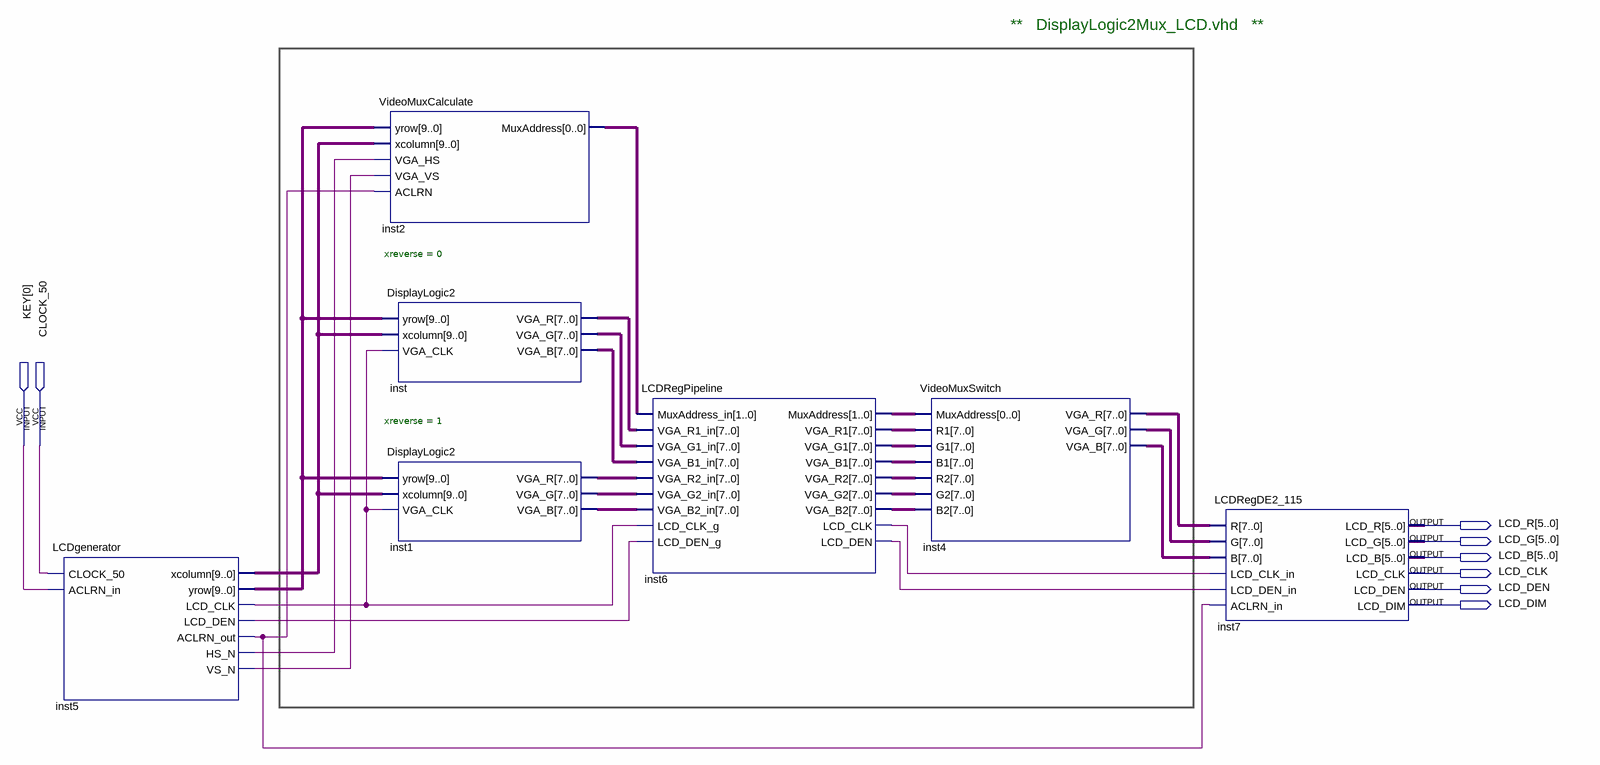
[diagram p0: schematic sheet]
// Quartus schematic DemoMux_LCD_OverviewInBDF.bdf as structural Verilog: 7 symbols, 8 pins
module DemoMux_LCD_OverviewInBDF (
  input  [0:0] KEY,
  input  CLOCK_50,
  output [5:0] LCD_R,
  output [5:0] LCD_G,
  output [5:0] LCD_B,
  output LCD_CLK,
  output LCD_DEN,
  output LCD_DIM
);

  wire inst5_aclrn_out, inst5_hs_n, inst5_lcd_clk, inst5_lcd_den, inst5_vs_n, inst6_lcd_clk, inst6_lcd_den;
  wire [1:0] inst2_muxaddress, inst6_muxaddress;
  wire [7:0] inst1_vga_b, inst1_vga_g, inst1_vga_r, inst4_vga_b, inst4_vga_g, inst4_vga_r, inst6_vga_b1,
       inst6_vga_b2, inst6_vga_g1, inst6_vga_g2, inst6_vga_r1, inst6_vga_r2, inst_vga_b, inst_vga_g,
       inst_vga_r;
  wire [9:0] inst5_xcolumn, inst5_yrow;

  LCDgenerator inst5 (
    .CLOCK_50(CLOCK_50), .ACLRN_in(KEY[0]), .xcolumn(inst5_xcolumn), .yrow(inst5_yrow),
    .LCD_CLK(inst5_lcd_clk), .LCD_DEN(inst5_lcd_den), .ACLRN_out(inst5_aclrn_out), .HS_N(inst5_hs_n),
    .VS_N(inst5_vs_n));
  VideoMuxCalculate inst2 (
    .yrow(inst5_yrow), .xcolumn(inst5_xcolumn), .VGA_HS(inst5_hs_n), .VGA_VS(inst5_vs_n),
    .ACLRN(inst5_aclrn_out), .MuxAddress(inst2_muxaddress));
  DisplayLogic2 #(.xreverse(0)) inst (
    .yrow(inst5_yrow), .xcolumn(inst5_xcolumn), .VGA_CLK(inst5_lcd_clk), .VGA_R(inst_vga_r),
    .VGA_G(inst_vga_g), .VGA_B(inst_vga_b));
  DisplayLogic2 #(.xreverse(1)) inst1 (
    .yrow(inst5_yrow), .xcolumn(inst5_xcolumn), .VGA_CLK(inst5_lcd_clk), .VGA_R(inst1_vga_r),
    .VGA_G(inst1_vga_g), .VGA_B(inst1_vga_b));
  LCDRegPipeline inst6 (
    .MuxAddress_in(inst2_muxaddress), .VGA_R1_in(inst_vga_r), .VGA_G1_in(inst_vga_g), .VGA_B1_in(inst_vga_b),
    .VGA_R2_in(inst1_vga_r), .VGA_G2_in(inst1_vga_g), .VGA_B2_in(inst1_vga_b), .LCD_CLK_g(inst5_lcd_clk),
    .LCD_DEN_g(inst5_lcd_den), .MuxAddress(inst6_muxaddress), .VGA_R1(inst6_vga_r1), .VGA_G1(inst6_vga_g1),
    .VGA_B1(inst6_vga_b1), .VGA_R2(inst6_vga_r2), .VGA_G2(inst6_vga_g2), .VGA_B2(inst6_vga_b2),
    .LCD_CLK(inst6_lcd_clk), .LCD_DEN(inst6_lcd_den));
  VideoMuxSwitch inst4 (
    .MuxAddress(inst6_muxaddress), .R1(inst6_vga_r1), .G1(inst6_vga_g1), .B1(inst6_vga_b1),
    .R2(inst6_vga_r2), .G2(inst6_vga_g2), .B2(inst6_vga_b2), .VGA_R(inst4_vga_r), .VGA_G(inst4_vga_g),
    .VGA_B(inst4_vga_b));
  LCDRegDE2_115 inst7 (
    .R(inst4_vga_r), .G(inst4_vga_g), .B(inst4_vga_b), .LCD_CLK_in(inst6_lcd_clk),
    .LCD_DEN_in(inst6_lcd_den), .ACLRN_in(inst5_aclrn_out), .LCD_R(LCD_R), .LCD_G(LCD_G), .LCD_B(LCD_B),
    .LCD_CLK(LCD_CLK), .LCD_DEN(LCD_DEN), .LCD_DIM(LCD_DIM));

  // Notes on the sheet:
  //   **   DisplayLogic2Mux_LCD.vhd   ** 
endmodule
